# EAGLE design rapidshark-main-breakout-top-teensy-mk-1.0 (EAGLE 7.5.0)
AUTHOR: sean@yak.net
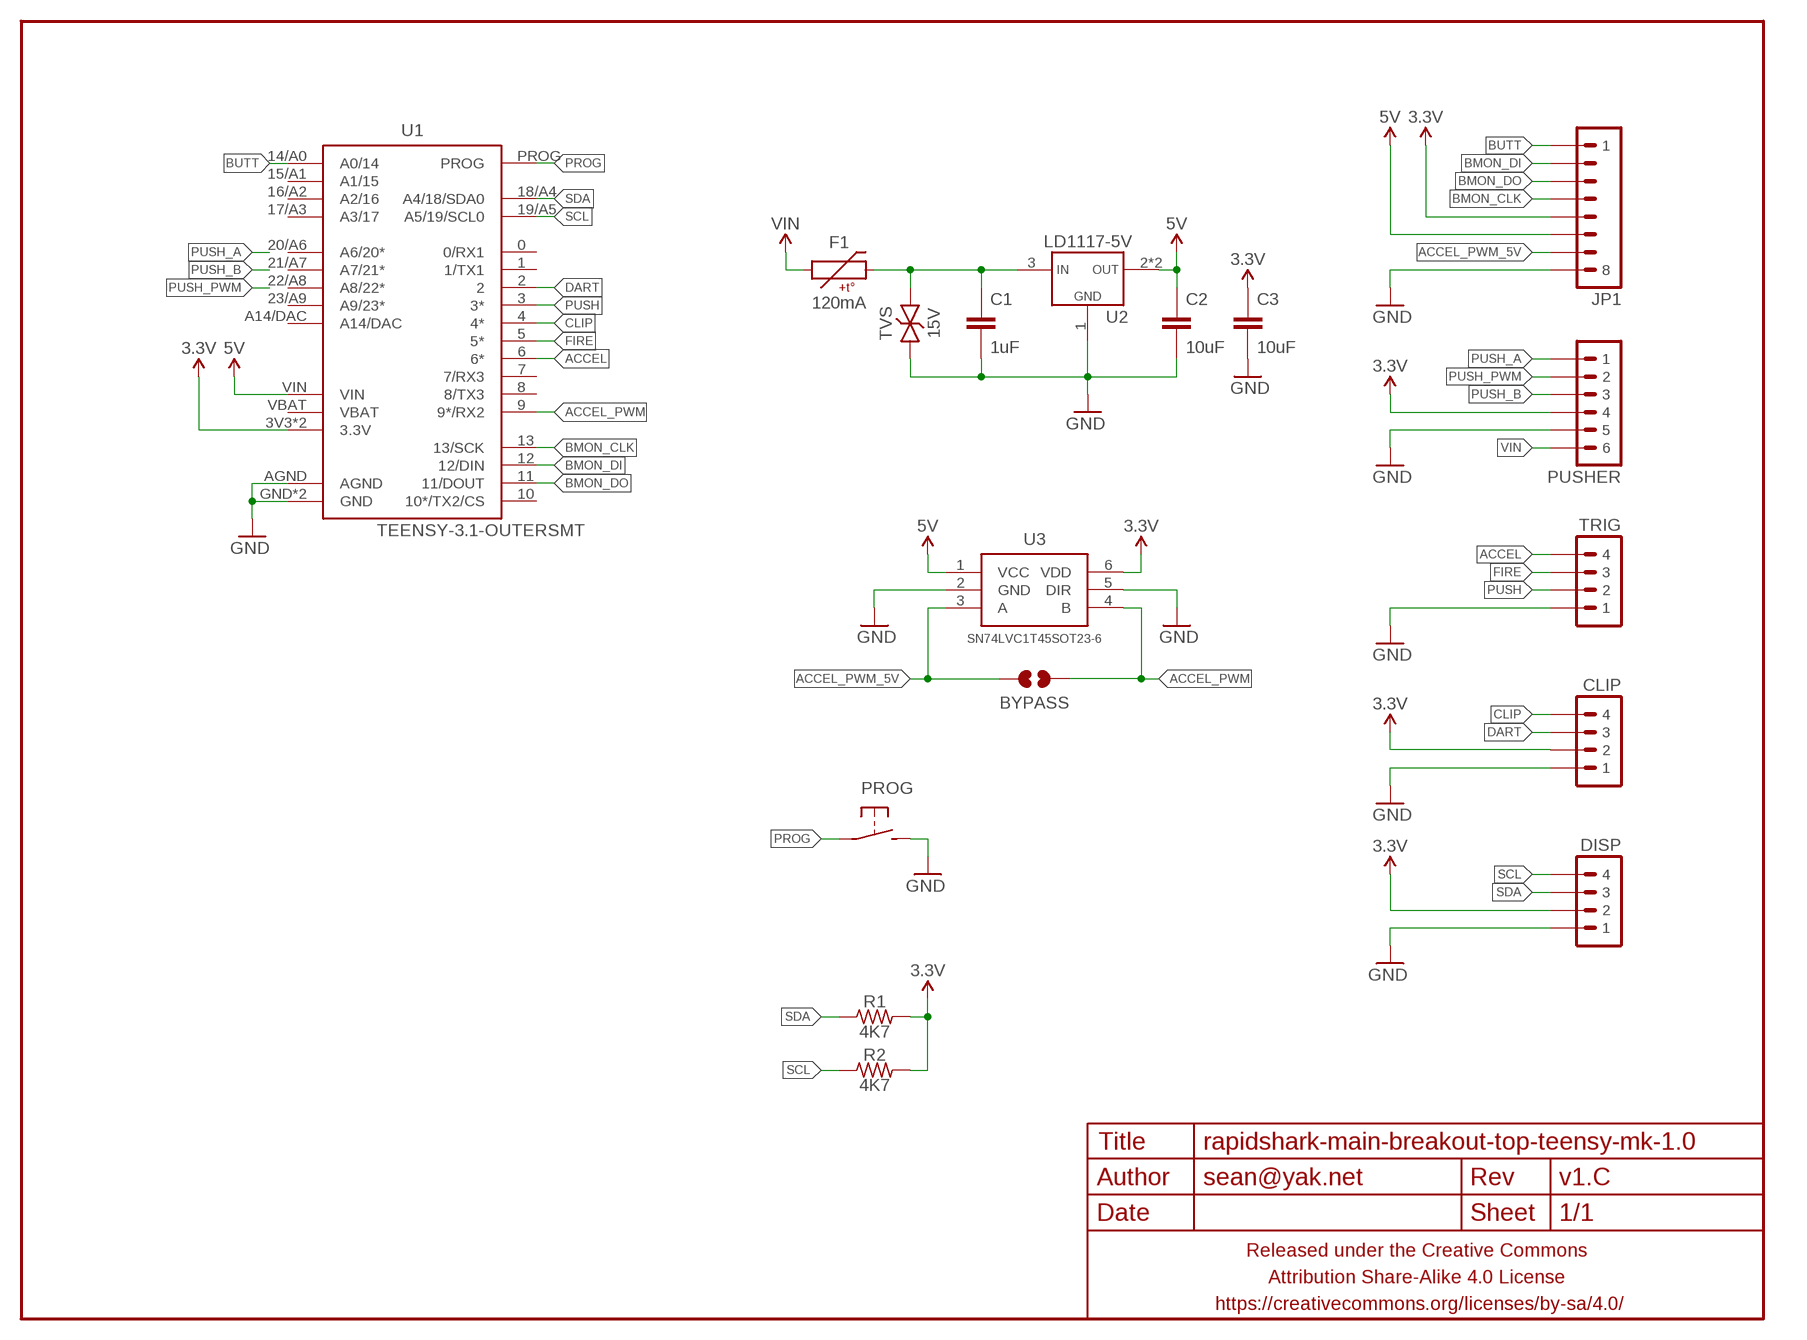
[diagram p0: schematic, sheet 1]

## Parts
BYPASS  JUMPER-PAD-2-NOYES_SILK  [PAD-JUMPER-2-NO_YES_SILK]
C1  1uF  CAPACITOR-CERAMICC0603  [C0603]
C2  10uF  CAPACITOR-CERAMICC0805  [C0805]
C3  10uF  CAPACITOR-CERAMICC0805  [C0805]
CLIP  M04JST-PTH-VERT  [JST-4-PH-VERT-PTH]
DISP  M04JST-PTH-VERT  [JST-4-PH-VERT-PTH]
F1  120mA  PTCSMD  [PTC-1206]
FRAME1  FRAME-LETTERNO_PACKAGE  [DUMMY]
JP1  M08SMD-RA-MALE-2MM  [1X08_SMD_RA_MALE_2MM]
PROG  SPST-NO-TACTCK-PTS840-GK  [TACTILE-SMD-CK-PTS840-GK]
PUSHER  M06JST-PH-PTH-VERT  [JST-6-PH-VERT-PTH]
R1  4K7  RESISTORR0603-TIGHTER  [R0603-TIGHTER]
R2  4K7  RESISTORR0603-TIGHTER  [R0603-TIGHTER]
TRIG  M04JST-PTH-VERT  [JST-4-PH-VERT-PTH]
TVS  15V  TVSSMA  [SMA-DIODE-TVS-BIDIR]
U1  TEENSY-3.1-OUTERSMT  [TEENSY-3.1_SMT_BOTTOM_OUTERONLY]
U2  LD1117-5V  VREG_1117SOT223  [SOT223]
U3  SN74LVC1T45SOT23-6  [SOT23-6]

## Nets
3.3V: C3.1 CLIP.2 DISP.2 JP1.5 PUSHER.4 R1.2 R2.2 U1.3V3(3.3V) U1.3V3@1(3.3V) U3.6(VDD)
5V: C2.1 JP1.6 U1.VIN U2.2(VOUT) U2.4(VOUT) U3.1(VCC)
ACCEL: TRIG.4 U1.6(6*)
ACCEL_PWM: BYPASS.1 U1.9(9*/RX2) U3.4(B)
ACCEL_PWM_5V: BYPASS.2 JP1.7 U3.3(A)
BMON_CLK: JP1.4 U1.13(13/SCK)
BMON_DI: JP1.2 U1.12(12/DIN)
BMON_DO: JP1.3 U1.11(11/DOUT)
BUTT: JP1.1 U1.14/A0(A0/14)
CLIP: CLIP.4 U1.4(4*)
DART: CLIP.3 U1.2
FIRE: TRIG.3 U1.5(5*)
GND: C1.2 C2.2 C3.2 CLIP.1 DISP.1 JP1.8 PROG.3 PROG.4 PUSHER.5 TRIG.1 TVS.1 U1.AGND U1.GND U1.GND@1(GND) U2.1(GND) U3.2(GND) U3.5(DIR)
N$1: C1.1 F1.2 TVS.2 U2.3(VIN)
PROG: PROG.1 PROG.2 U1.PROG
PUSH: TRIG.2 U1.3(3*)
PUSH_A: PUSHER.1
PUSH_B: PUSHER.3
PUSH_PWM: PUSHER.2
SCL: DISP.4 R2.1 U1.19/A5(A5/19/SCL0)
SDA: DISP.3 R1.1 U1.18/A4(A4/18/SDA0)
VIN: F1.1 PUSHER.6
Unconnected: U1.0(0/RX1) U1.1(1/TX1) U1.7(7/RX3) U1.8(8/TX3) U1.10(10*/TX2/CS) U1.15/A1(A1/15) U1.16/A2(A2/16) U1.17/A3(A3/17) U1.20/A6(A6/20*) U1.21/A7(A7/21*) U1.22/A8(A8/22*) U1.23/A9(A9/23*) U1.A14/DAC U1.VBAT

## Library data of the parts
BYPASS = a_parts:JUMPER-PAD-2-NO
C1-C3 = a_parts:CAPACITOR-CERAMIC: CAPACITOR, European symbol
CLIP DISP TRIG = a_parts:M04: Header 4 Standard 4-pin 0.1" header. Use with straight break away headers (SKU : PRT-00116), right angle break away headers (PRT-00553), swiss pins (PRT-00743), machine pins (PRT-00117), and female headers (PRT-00115). Molex polarized connector foot print use with SKU : PRT-08231 with associated crimp pins and housings. 1MM SMD Version SKU: PRT-10208
F1 = a_parts:PTC: Resettable Fuse PTC Resettable Fuse. Spark Fun Electronics SKU : COM-08357; PROD_ID: RES-11150
FRAME1 = a_parts:FRAME-LETTER: Schematic Frame Standard 8.5x11 US Letter frame; DESIGNER: sean@yak.net; VERSION: v1.C
JP1 = a_parts:M08: Header 8 Standard 8-pin 0.1" header. Use with straight break away headers (SKU : PRT-00116), right angle break away headers (PRT-00553), swiss pins (PRT-00743), machine pins (PRT-00117), and female headers (PRT-00115).
PROG = a_parts:SPST-NO-TACT
PUSHER = a_parts:M06: Header 6 Standard 6-pin 0.1" header. Use with straight break away headers (SKU : PRT-00116), right angle break away headers (PRT-00553), swiss pins (PRT-00743), machine pins (PRT-00117), and female headers (PRT-00115). Molex polarized connector foot print use with SKU : PRT-08094 with associated crimp pins and housings. NOTES ON THE VARIANTS LOCK and LOCK_LONGPADS... This footprint was designed to help hold the alignment of a through-hole component (i.e. 6-pin header) while soldering it into place. You may notice that each hole has been shifted either up or down by 0.005 of an inch from it's more standard position (which is a perfectly straight line). This slight alteration caused the pins (the squares in the middle) to touch the edges of the holes. Because they are alternating, it causes a "brace" to hold the component in place. 0.005 has proven to be the perfect amount of "off-center" position when using our standard breakaway headers. Although looks a little odd when you look at the bare footprint, once you have a header in there, the alteration is very hard to notice. Also,if you push a header all the way into place, it is covered up entirely on the bottom side. This idea of altering the position of holes to aid alignment will be further integrated into the Sparkfun Library for other footprints. It can help hold any component with 3 or more connection pins.
R1 R2 = a_parts:RESISTOR: RESISTOR, American symbol
TVS = a_parts:TVS: Transient voltage suppressor- prevents ESD on inputs. Ignore package description- MBRA140 is NOT this type of part!!!
U1 = a_parts:TEENSY-3.1-OUTER
U2 = a_parts:VREG_1117
U3 = a_parts:SN74LVC1T45

## Board
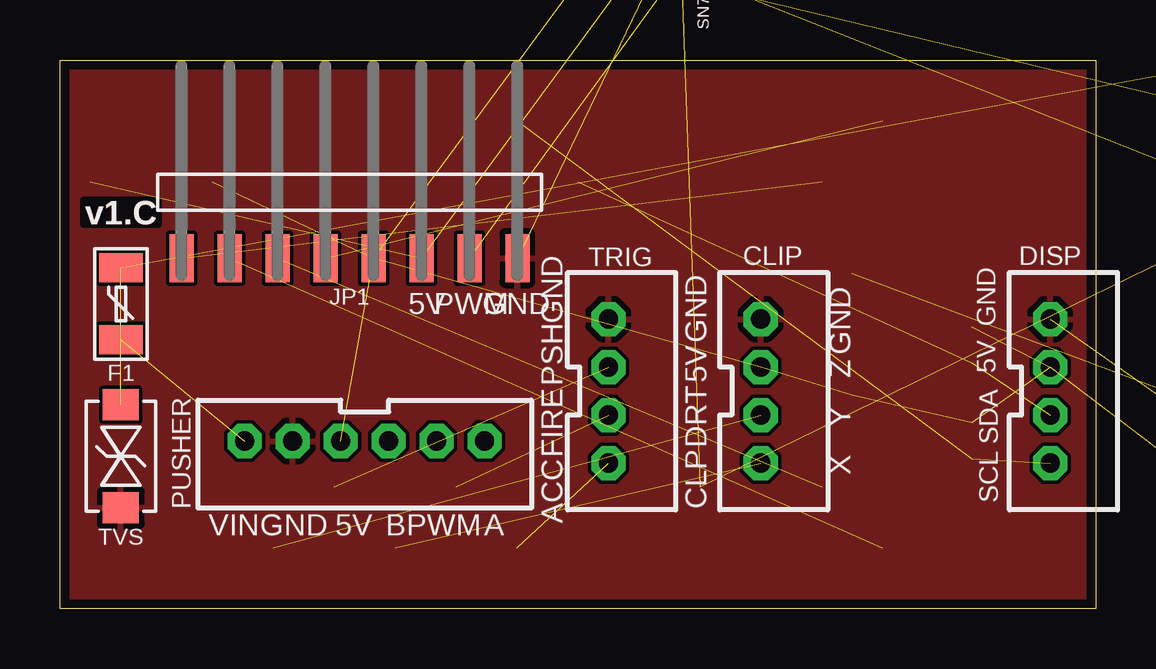
[diagram p1: board, top side]
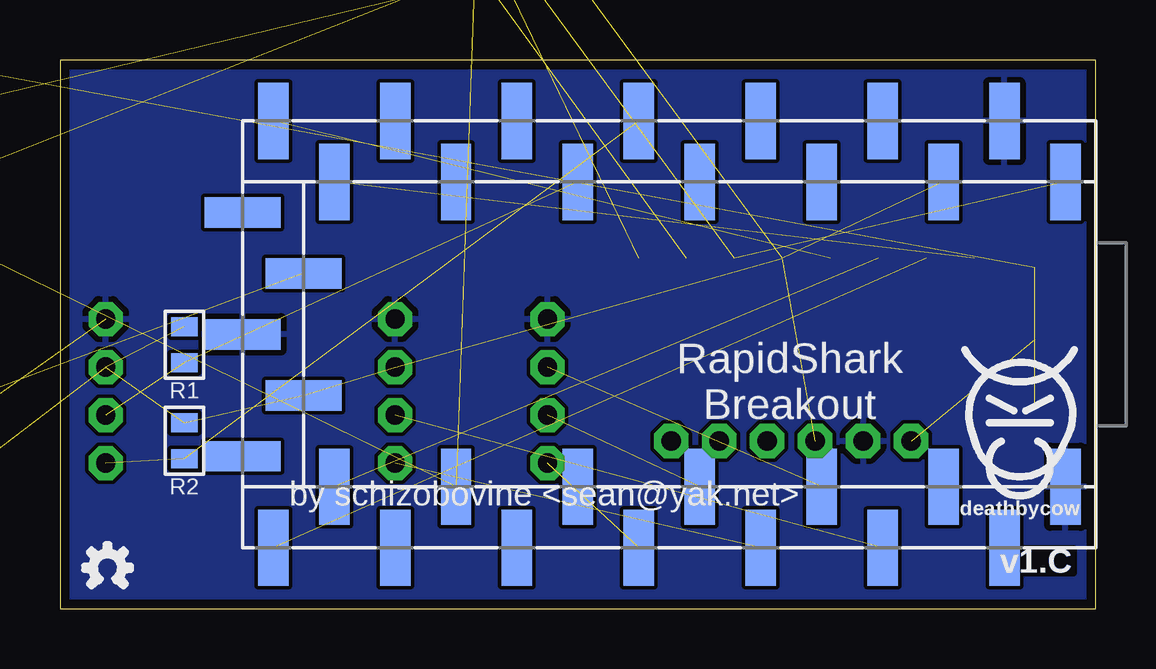
[diagram p2: board, bottom side, seen from below]

Size 43.18 x 22.86 mm. Coordinates in mm from the lower left corner, seen from the top.
Outline: 0,22.86 43.18,22.86 43.18,0 0,0 0,22.86
Copper layers (1*16): Top 0.0356mm / dielectric 1.5011mm / Bottom 0.0356mm
Design rules "LaenPCBOrder_2": minimum track width 6mil, minimum drill 13mil, track to track 6mil, track to pad 6mil, pad to pad 6mil, via to via 6mil, smd to smd 6mil, copper to edge 15mil, drill to drill 6mil, minimum pad ring 7mil, minimum via ring 7mil, stop-mask expansion 3mil, vias tented up to drill 20mil, thermal gap 10mil

### Footprints (pad centres in the part's own frame; a part is rotated, then mirrored left to right if it is on the bottom)
PAD-JUMPER-2-NO_YES_SILK = smd 0.635 x 1.27: 1 -0.45,0; 2 0.45,0
C0603 = smd 1 x 1.1: 1 -0.85,0; 2 0.85,0
C0805 = smd 1.3 x 1.5: 1 -0.95,0; 2 0.95,0
JST-4-PH-VERT-PTH = drill 0.8 pad 1.422 octagon: 1 0,0; 2 2,0; 3 4,0; 4 6,0
PTC-1206 = smd 1.2 x 1.8: 1 -1.5,0; 2 1.5,0
1X08_SMD_RA_MALE_2MM = smd 1 x 2: 1 -7,0; 2 -5,0; 3 -3,0; 4 -1,0; 5 1,0; 6 3,0; 7 5,0; 8 7,0
TACTILE-SMD-CK-PTS840-GK = smd 1.4 x 1: 1 -1.8,0.75; 2 1.8,0.75; 3 -1.8,-0.75; 4 1.8,-0.75 | hole 0.7: 0,-0.9; 0,0.9
JST-6-PH-VERT-PTH = drill 0.8 pad 1.422 octagon: 1 -5,0; 2 -3,0; 3 -1,0; 4 1,0; 5 3,0; 6 5,0
R0603-TIGHTER = smd 0.8 x 1.1: 1 -0.75,0; 2 0.75,0
SMA-DIODE-TVS-BIDIR = smd 1.3 x 1.5: 1 -2.15,0; 2 2.15,0
TEENSY-3.1_SMT_BOTTOM_OUTERONLY = smd 3.175 x 1.27 bottom: 0 8.89,-13.97; 1 6.35,-11.43; 2 8.89,-8.89; 3 6.35,-6.35; 3V3@1 -6.35,-11.43; 4 8.89,-3.81; 5 6.35,-1.27; 6 8.89,1.27; 7 6.35,3.81; 8 8.89,6.35; 9 6.35,8.89; 10 8.89,11.43; 11 6.35,13.97; 12 8.89,16.51; 13 -8.89,16.51; 14/A0 -6.35,13.97; 15/A1 -8.89,11.43; 16/A2 -6.35,8.89; 17/A3 -8.89,6.35; 18/A4 -6.35,3.81; 19/A5 -8.89,1.27; 20/A6 -6.35,-1.27; 21/A7 -8.89,-3.81; 22/A8 -6.35,-6.35; 23/A9 -8.89,-8.89; AGND -8.89,-13.97; GND 6.35,-16.51; VIN -6.35,-16.51 | smd 1.27 x 3.175 bottom: 3V3 2.54,15.24; A14/DAC -5.08,17.78; GND@1 0,17.78; PROG -2.54,15.24; VBAT 5.08,17.78
SOT223 = smd 1.219 x 2.235: 1 -2.311,-3.099; 2 0,-3.099; 3 2.311,-3.099 | smd 3.6 x 2.2: 4 0,3.099
SOT23-6 = smd 0.6 x 1.05: 1 -0.95,-1.35; 2 0,-1.35; 3 0.95,-1.35; 4 0.95,1.35; 5 0,1.35; 6 -0.95,1.35

### Placement (x,y rotation side)
BYPASS  50.73,16.59 0 top  (outside the outline)
C1  51.83,23.18 0 top  (outside the outline)
C2  51.83,20.18 0 top  (outside the outline)
C3  51.53,2.98 0 top  (outside the outline)
CLIP  29.21,12.06 270 top
DISP  41.27,12.06 270 top
F1  2.54,12.7 90 top
FRAME1  0,0 270 bottom
JP1  12.06,14.61 0 top
PROG  51.23,7.08 0 top  (outside the outline)
PUSHER  12.7,6.99 180 top
R1  38,11 90 bottom
R2  38,7 90 bottom
TRIG  22.86,12.06 270 top
TVS  2.54,6.35 90 top
U1  17.78,11.43 270 top
U2  52.13,29.39 0 top  (outside the outline)
U3  24.85,27.99 0 top  (outside the outline)
U$2  [COW_SMALL]  3.17,8.26 0 bottom
U$3  [OSHWLOGO_TINY_SILKONLY]  41.2,1.7 0 bottom

### Tracks (layer width: path | path; a pad name or v marks a point on that pad's centre or on a via)
3.3V  (9 unrouted)
5V  (5 unrouted)
ACCEL  (1 unrouted)
ACCEL_PWM  (2 unrouted)
ACCEL_PWM_5V  (2 unrouted)
BMON_CLK  (1 unrouted)
BMON_DI  (1 unrouted)
BMON_DO  (1 unrouted)
BUTT  (1 unrouted)
CLIP  (1 unrouted)
DART  (1 unrouted)
FIRE  (1 unrouted)
GND  (8 unrouted)
  pour Top (rank 6): 0,22.86 43.18,22.86 43.18,0 0,0
  pour Bottom (rank 6): 0,22.86 43.18,22.86 43.18,0 0,0
N$1  (3 unrouted)
PROG  (2 unrouted)
PUSH  (1 unrouted)
SCL  (2 unrouted)
SDA  (2 unrouted)
VIN  (1 unrouted)

### Text on the board
tPlace: 5V | PWM | GND | GND | GND | GND | GND | PSH | 5V | Z | 5V | FIRE | DRT | Y | SDA | X | SCL | ACC | CLP | VIN | GND | 5V | B | PWM | A
bPlace: RapidShark / Breakout | by schizobovine <sean@yak.net>